# Altium schematic sheet msr501.SchDoc
size A4
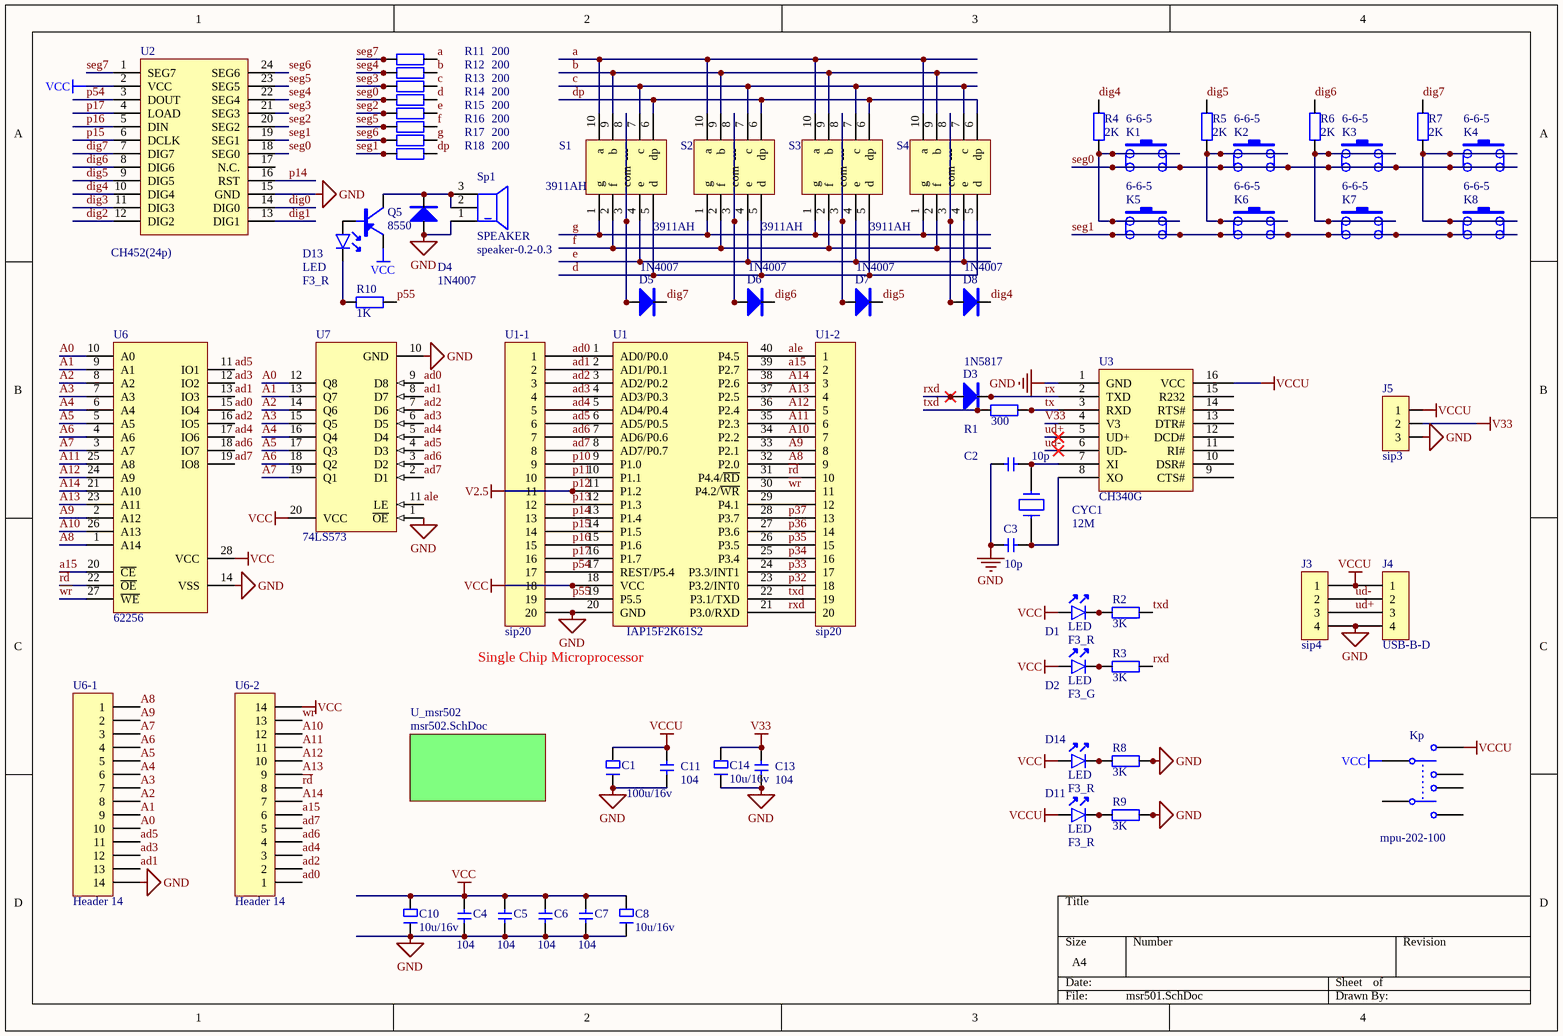
[diagram p0: msr501.SchDoc]

## Parts
C1  100u/16v  [rb.1/.2]
C2  value 10p  [CAP010805]  (hidden comment: CAP)
C3  value 10p  [CAP010805]  (hidden comment: CAP)
C4  104  [CAP010805]
C5  104  [CAP010805]
C6  104  [CAP010805]
C7  104  [CAP010805]
C8  value 10u/16v  [rb.1/.2]  (hidden comment: 100u/16v)
C10  value 10u/16v  [rb.1/.2]  (hidden comment: 100u/16v)
C11  104  [CAP010805]
C13  104  [CAP010805]
C14  10u/16v  [rb.1/.2]
CYC1  value 12M  [cyc-rad]  (hidden comment: 12Mhz)
D1  LED  value F3_R  [led-3]
D2  LED  value F3_G  [led-3]
D3  value 1N5817  [smc03]  (hidden comment: sma03)
D4  value 1N4007  [smc03]  (hidden comment: sma03)
D5  value 1N4007  [smc03]  (hidden comment: sma03)
D6  value 1N4007  [smc03]  (hidden comment: sma03)
D7  value 1N4007  [smc03]  (hidden comment: sma03)
D8  value 1N4007  [smc03]  (hidden comment: sma03)
D11  LED  value F3_R  [led-3]
D13  LED  value F3_R  [led-3]
D14  LED  value F3_R  [led-3]
J3  value sip4  [SIP4]  (hidden comment: USB-a)
J4  value USB-B-D  [USB_b]
J5  value sip3  [SIP3]  (hidden comment: CON3)
K1  6-6-5  [pb6_6]
K2  6-6-5  [pb6_6]
K3  6-6-5  [pb6_6]
K4  6-6-5  [pb6_6]
K5  6-6-5  [pb6_6]
K6  6-6-5  [pb6_6]
K7  6-6-5  [pb6_6]
K8  6-6-5  [pb6_6]
Kp  value mpu-202-100  [DPDT-6]  (hidden comment: SW-DPDT)
Q5  8550  [to-92a]
R1  value 300  [a038050]  (hidden comment: Res2)
R2  value 3K  [a038050]  (hidden comment: Res2)
R3  value 3K  [a038050]  (hidden comment: Res2)
R4  value 2K  [a038050]  (hidden comment: Res2)
R5  value 2K  [a038050]  (hidden comment: Res2)
R6  value 2K  [a038050]  (hidden comment: Res2)
R7  value 2K  [a038050]  (hidden comment: Res2)
R8  value 3K  [a038050]  (hidden comment: Res2)
R9  value 3K  [a038050]  (hidden comment: Res2)
R10  value 1K  [a038050]  (hidden comment: Res2)
R11  value 200  [a038050]  (hidden comment: Res2)
R12  value 200  [a038050]  (hidden comment: Res2)
R13  value 200  [a038050]  (hidden comment: Res2)
R14  value 200  [a038050]  (hidden comment: Res2)
R15  value 200  [a038050]  (hidden comment: Res2)
R16  value 200  [a038050]  (hidden comment: Res2)
R17  value 200  [a038050]  (hidden comment: Res2)
R18  value 200  [a038050]  (hidden comment: Res2)
S1  3911AH  [LED10s]
S2  3911AH  [LED10s]
S3  3911AH  [LED10s]
S4  3911AH  [LED10s]
Sp1  SPEAKER  value speaker-0.2-0.3  [sp0.23]
U1  value IAP15F2K61S2  [DIP40]  (hidden comment: 单片机IAP15F2K61S2)
U1-1  value sip20  [HDR1X20]  (hidden comment: Header 20)
U1-2  value sip20  [HDR1X20]  (hidden comment: Header 20)
U2  value CH452(24p)  [dip24]  (hidden comment: CH451)
U3  CH340G  [SOP-16]
U6  62256  [62256]
U6-1  Header 14  [HDR1X14C]
U6-2  Header 14  [HDR1X14C]
U7  value 74LS573  [DIP20]  (hidden comment: DM74LS573N)

## Sub-sheets
U_msr502 = msr502.SchDoc: no entries

## Nets
GND: C1.1 C2.2 C3.2 C4.2 C5.2 C6.2 C7.2 C8.1 C10.1 C11.2 C13.2 C14.1 D4.2 D4.4 J3.4 J4.4 J5.3 R8.1 R8.3 R9.1 R9.3 Sp1.1 U1.20(GND) U1-1.20 U2.15(GND) U3.1(GND) U6.14(VSS) U6-1.14 U7.1(~{OE}) U7.10(GND)
p12: U1.11(P1.2) U1-1.11  [also labelled V2.5]
V33: C13.1 C14.2 J5.2 U3.4(V3)
VCC: C4.1 C5.1 C6.1 C7.1 C8.2 C10.2 D1.1 D2.1 D14.1 Kp.2 Q5.1(E) U1.18(VCC) U1-1.18 U2.2(VCC) U6.28(VCC) U6-2.14 U7.20(VCC)
VCCU: C1.2 C11.1 D11.1 J3.1 J4.1 J5.1 Kp.1 U3.16(VCC)
a: R11.1 R11.3 S1.10(a) S2.10(a) S3.10(a) S4.10(a)
A0: U6.10(A0) U6-1.10 U7.12(Q8)
A1: U6.9(A1) U6-1.9 U7.13(Q7)
A2: U6.8(A2) U6-1.8 U7.14(Q6)
A3: U6.7(A3) U6-1.7 U7.15(Q5)
A4: U6.6(A4) U6-1.6 U7.16(Q4)
A5: U6.5(A5) U6-1.5 U7.17(Q3)
A6: U6.4(A6) U6-1.4 U7.18(Q2)
A7: U6.3(A7) U6-1.3 U7.19(Q1)
A8: U1.32(P2.0) U1-2.9 U6.1(A14) U6-1.1
A9: U1.33(P2.1) U1-2.8 U6.2(A12) U6-1.2
A10: U1.34(P2.2) U1-2.7 U6.26(A13) U6-2.12
A11: U1.35(P2.3) U1-2.6 U6.25(A8) U6-2.11
A12: U1.36(P2.4) U1-2.5 U6.24(A9) U6-2.10
A13: U1.37(P2.5) U1-2.4 U6.23(A11) U6-2.9
A14: U1.38(P2.6) U1-2.3 U6.21(A10) U6-2.7
a15: U1.39(P2.7) U1-2.2 U6.20(~{CE}) U6-2.6
ad0: U1.1(AD0/P0.0) U1-1.1 U6.15(IO4) U6-2.1 U7.9(D8)
ad1: U1.2(AD1/P0.1) U1-1.2 U6.13(IO3) U6-1.13 U7.8(D7)
ad2: U1.3(AD2/P0.2) U1-1.3 U6.16(IO5) U6-2.2 U7.7(D6)
ad3: U1.4(AD3/P0.3) U1-1.4 U6.12(IO2) U6-1.12 U7.6(D5)
ad4: U1.5(AD4/P0.4) U1-1.5 U6.17(IO6) U6-2.3 U7.5(D4)
ad5: U1.6(AD5/P0.5) U1-1.6 U6.11(IO1) U6-1.11 U7.4(D3)
ad6: U1.7(AD6/P0.6) U1-1.7 U6.18(IO7) U6-2.4 U7.3(D2)
ad7: U1.8(AD7/P0.7) U1-1.8 U6.19(IO8) U6-2.5 U7.2(D1)
ale: U1.40(P4.5) U1-2.1 U7.11(LE)
b: R12.1 R12.3 S1.9(b) S2.9(b) S3.9(b) S4.9(b)
c: R13.1 R13.3 S1.7(c) S2.7(c) S3.7(c) S4.7(c)
d: R14.1 R14.3 S1.5(d) S2.5(d) S3.5(d) S4.5(d)
dig0: U2.14(DIG0)
dig1: U2.13(DIG1)
dig2: U2.12(DIG2)
dig3: U2.11(DIG3)
dig4: D8.1 D8.3 R4.2 R4.4 U2.10(DIG4)
dig5: D7.1 D7.3 R5.2 R5.4 U2.9(DIG5)
dig6: D6.1 D6.3 R6.2 R6.4 U2.8(DIG6)
dig7: D5.1 D5.3 R7.2 R7.4 U2.7(DIG7)
dp: R18.1 R18.3 S1.6(dp) S2.6(dp) S3.6(dp) S4.6(dp)
e: R15.1 R15.3 S1.4(e) S2.4(e) S3.4(e) S4.4(e)
f: R16.1 R16.3 S1.2(f) S2.2(f) S3.2(f) S4.2(f)
g: R17.1 R17.3 S1.1(g) S2.1(g) S3.1(g) S4.1(g)
p10: U1.9(P1.0) U1-1.9
p11: U1.10(P1.1) U1-1.10
p13: U1.12(P1.3) U1-1.12
p14: U1.13(P1.4) U1-1.13 U2.16(RST)
p15: U1.14(P1.5) U1-1.14 U2.6(DCLK)
p16: U1.15(P1.6) U1-1.15 U2.5(DIN)
p17: U1.16(P1.7) U1-1.16 U2.4(LOAD)
p32: U1.23(P3.2/INT0) U1-2.18
p33: U1.24(P3.3/INT1) U1-2.17
p34: U1.25(P3.4) U1-2.16
p35: U1.26(P3.5) U1-2.15
p36: U1.27(P3.6) U1-2.14
p37: U1.28(P3.7) U1-2.13
p54: U1.17(REST/P5.4) U1-1.17 U2.3(DOUT)
p55: R10.1 R10.3 U1.19(P5.5) U1-1.19
~{rd}: U1.31(P4.4/~{RD}) U1-2.10 U6.22(~{OE}) U6-2.8
rx: D3.1 D3.3 U3.2(TXD)
rxd: D3.2 D3.4 R3.1 R3.3 U1.21(P3.0/RXD) U1-2.20
seg0: K1.2 K1.3 K2.2 K2.3 K3.2 K3.3 K4.2 K4.3 R14.2 R14.4 U2.18(SEG0)
seg1: K5.2 K5.3 K6.2 K6.3 K7.2 K7.3 K8.2 K8.3 R18.2 R18.4 U2.19(SEG1)
seg2: R15.2 R15.4 U2.20(SEG2)
seg3: R13.2 R13.4 U2.21(SEG3)
seg4: R12.2 R12.4 U2.22(SEG4)
seg5: R16.2 R16.4 U2.23(SEG5)
seg6: R17.2 R17.4 U2.24(SEG6)
seg7: R11.2 R11.4 U2.1(SEG7)
tx: R1.1 R1.3 U3.3(RXD)
txd: R1.2 R1.4 R2.1 R2.3 U1.22(P3.1/TXD) U1-2.19
ud+: J3.3 J4.3 U3.5(UD+)
ud-: J3.2 J4.2 U3.6(UD-)
~{wr}: U1.30(P4.2/~{WR}) U1-2.11 U6.27(~{WE}) U6-2.13
NetC2_1: C2.1 CYC1.2 U3.7(XI)
NetC3_1: C3.1 CYC1.1 U3.8(XO)
NetD1_2: D1.2 R2.2 R2.4
NetD2_2: D2.2 R3.2 R3.4
NetD4_1: D4.1 D4.3 Q5.3(C) Sp1.2 Sp1.3
NetD5_2: D5.2 D5.4 S1.3(com) S1.8(---)
NetD6_2: D6.2 D6.4 S2.3(com) S2.8(---)
NetD7_2: D7.2 D7.4 S3.3(com) S3.8(---)
NetD8_2: D8.2 D8.4 S4.3(com) S4.8(---)
NetD11_2: D11.2 R9.2 R9.4
NetD13_1: D13.1 Q5.2(B)
NetD13_2: D13.2 R10.2 R10.4
NetD14_2: D14.2 R8.2 R8.4
NetK1_1: K1.1 K1.4 K5.1 K5.4 R4.1 R4.3
NetK2_1: K2.1 K2.4 K6.1 K6.4 R5.1 R5.3
NetK3_1: K3.1 K3.4 K7.1 K7.4 R6.1 R6.3
NetK4_1: K4.1 K4.4 K8.1 K8.4 R7.1 R7.3
NetU1_29: U1.29(P4.1) U1-2.12

Not connected (* = marked no-connect by the designer): Kp 3 4 5 6; U2 17(N.C.); U3 9(CTS#) 10(DSR#) 11(RI#) 12(DCD#) 13(DTR#) 14(RTS#) 15(R232)

## Notes on the sheet
- Single Chip Microprocessor

## Library data of the parts
C1 C8 C10 C14 = ELECTRO1: Electrolytic Capacitor
  C1: Value: 100u/16v
  C14: Value: 10u/16v
C4-C7 C11 C13 = CAP: Capacitor; Value: 104
CYC1 = CRYSTAL
J3 J4 = CON4: Connector
J5 = CON3: Connector
K1-K8 = SW-PB2: value: 6-6-5
Kp = SW-DPDT: Double-Pole, Double-Throw Switch; Published: 24-Mar-1999; LatestRevisionDate: 17-Jul-2002; LatestRevisionNote: Re-released for DXP Platform.; PackageReference: DPDT-6; Publisher: Altium Limited
Q5 = PNP: Value: 8550
R1-R18 = Res22: Resistor; Published: 8-Jun-2000; LatestRevisionDate: 17-Jul-2002; LatestRevisionNote: Re-released for DXP Platform.; PackageReference: AXIAL-0.4; Publisher: Altium Limited
S1-S4 = DS1: Value: 3911AH
Sp1 = SPEAKER: SPEAKER sip0.2/0.3
U1 = Component_3
U1-1 U1-2 = Header 20: Header, 20-Pin; LatestRevisionDate: 17-Jul-2002; LatestRevisionNote: Re-released for DXP Platform.; Publisher: Altium Limited
U6-1 U6-2 = Header 14: Header, 14-Pin; LatestRevisionDate: 17-Jul-2002; LatestRevisionNote: Re-released for DXP Platform.; Publisher: Altium Limited
U7 = DM74LS573N: Octal D Latch with 3-State Output; Published: 17-Jul-2002; LatestRevisionDate: 29-May-2009; LatestRevisionNote: Component Body Added.; DatasheetVersion: Mar-1998; PackageVersion: 2000; PackageReference: N20A; Publisher: Altium Limited; PackageDescription: DIP, 20-Pin, Row Spacing 7.62 mm, Pitch 2.54 mm; Code_JEDEC: MS-001-AD; ComponentLink1Description: Manufacturer Link; ComponentLink1URL: http://www.fairchildsemi.com/
U6 = 62256: value: 62256